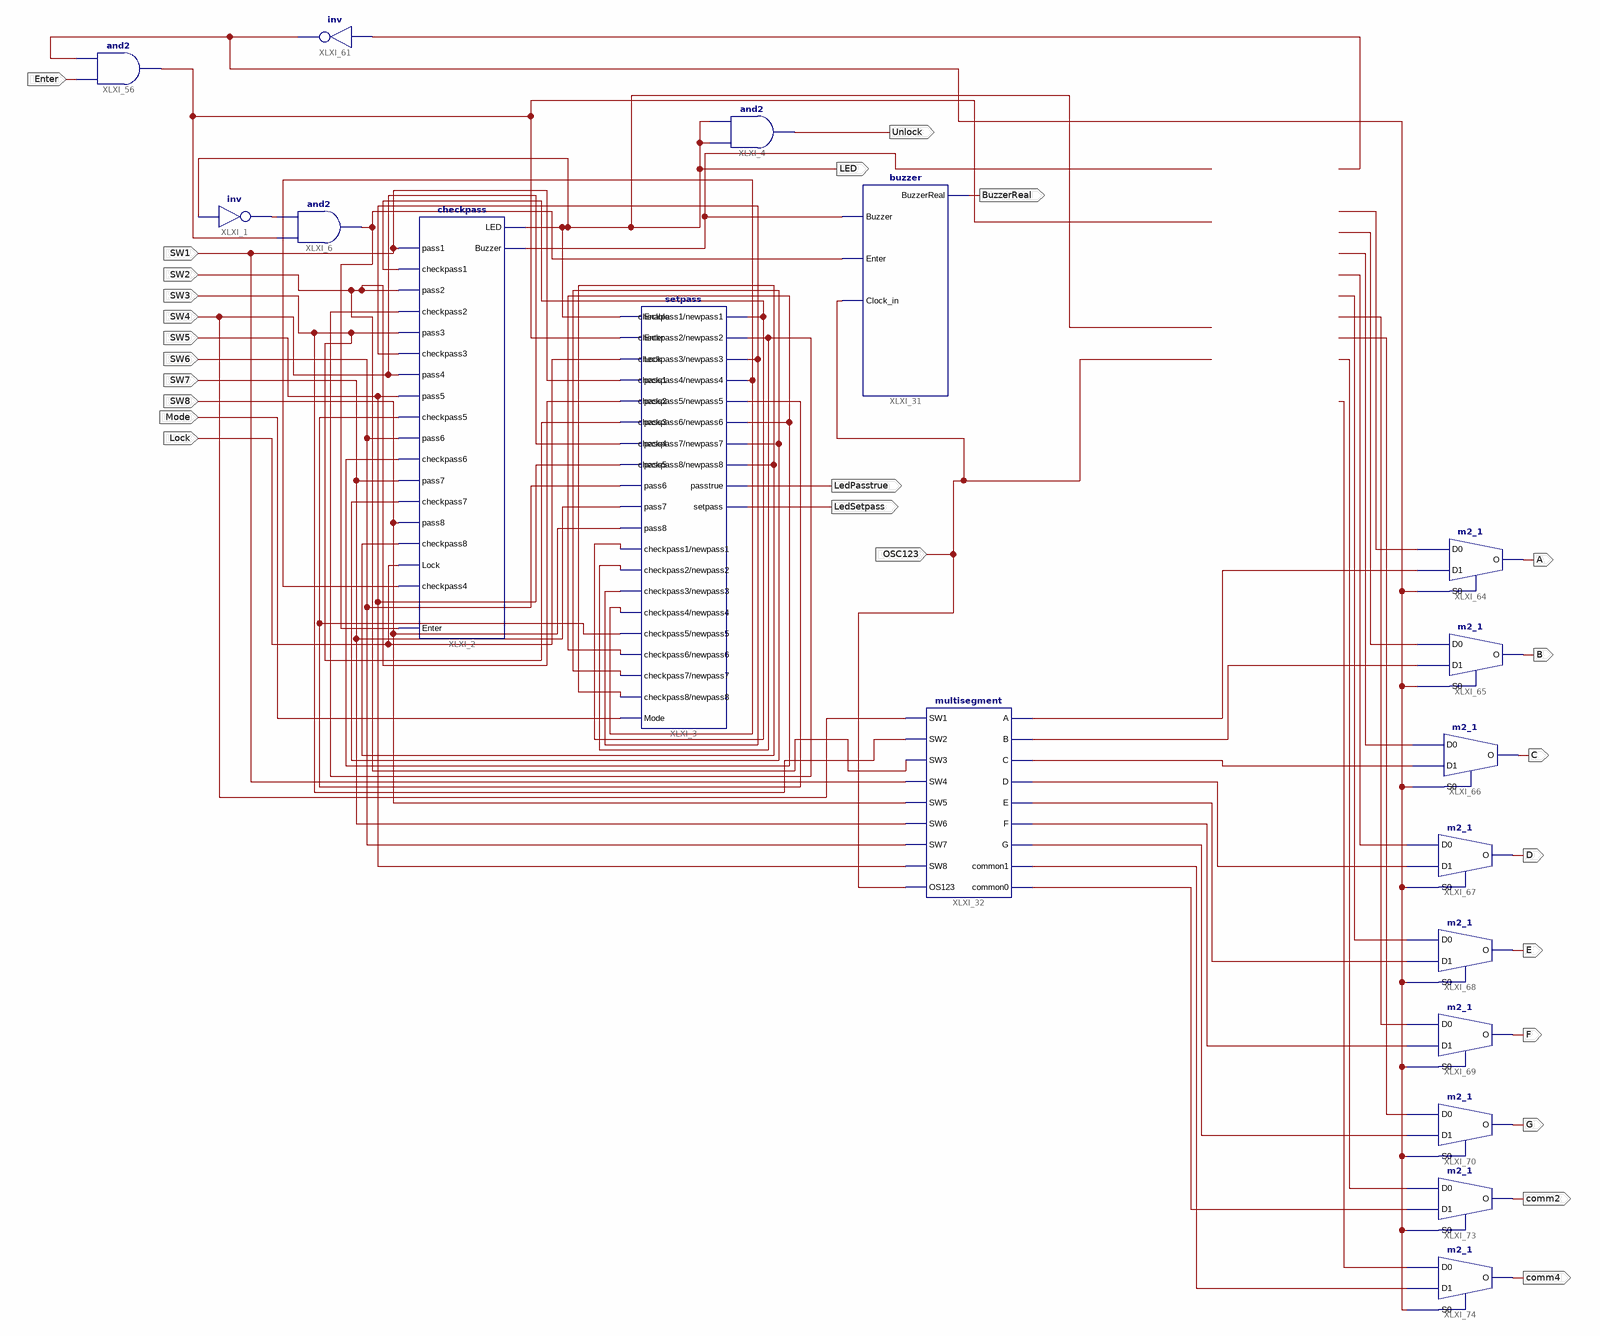
[diagram p0: schematic sheet 1]
// Xilinx ISE schematic test.sch (spartan6) as structural Verilog: 18 symbols, 26 ports
module test (
  input  Lock,
  input  Mode,
  input  SW1,
  input  SW4,
  input  SW5,
  input  SW6,
  input  SW7,
  input  SW8,
  input  SW2,
  input  SW3,
  input  OSC123,
  input  Enter,
  output LedPasstrue,
  output LedSetpass,
  output Unlock,
  output LED,
  output BuzzerReal,
  output comm2,
  output A,
  output B,
  output C,
  output D,
  output E,
  output F,
  output G,
  output comm4
);

  wire XLXN_2, XLXN_3, XLXN_6, XLXN_8, XLXN_10, XLXN_12, XLXN_16, XLXN_18, XLXN_89, XLXN_107, XLXN_109,
       XLXN_359, XLXN_360, XLXN_363, XLXN_364, XLXN_365, XLXN_366, XLXN_367, XLXN_368, XLXN_369, XLXN_371,
       XLXN_372, XLXN_373, XLXN_374, XLXN_375, XLXN_376, XLXN_377, XLXN_379, XLXN_382, XLXN_383, XLXN_403,
       XLXN_404;

  not XLXI_1 (XLXN_3, LED);
  checkpass XLXI_2 (
    .Lock(Lock), .pass1(SW1), .checkpass1(XLXN_16), .pass2(SW2), .checkpass2(XLXN_6), .pass3(SW3),
    .checkpass3(XLXN_107), .pass4(SW4), .checkpass4(XLXN_18), .pass5(SW5), .checkpass5(XLXN_89), .pass6(SW6),
    .checkpass6(XLXN_12), .pass7(SW7), .checkpass7(XLXN_10), .pass8(SW8), .checkpass8(XLXN_8),
    .Enter(XLXN_109), .LED(LED), .Buzzer(XLXN_2));
  setpass XLXI_3 (
    .checkpass1(XLXN_16), .checkpass2(XLXN_6), .checkpass3(XLXN_107), .checkpass4(XLXN_18),
    .checkpass5(XLXN_89), .checkpass6(XLXN_12), .checkpass7(XLXN_10), .checkpass8(XLXN_8), .Enable(LED),
    .Enter(XLXN_359), .Lock(Lock), .Mode(Mode), .newpass1(XLXN_16), .newpass2(XLXN_6), .newpass3(XLXN_107),
    .newpass4(XLXN_18), .newpass5(XLXN_89), .newpass6(XLXN_12), .newpass7(XLXN_10), .newpass8(XLXN_8),
    .pass1(SW1), .pass2(SW2), .pass3(SW3), .pass4(SW4), .pass5(SW5), .pass6(SW6), .pass7(SW7), .pass8(SW8),
    .passtrue(LedPasstrue), .setpass(LedSetpass));
  and XLXI_4 (Unlock, LED, LED);
  buzzer XLXI_31 (.Buzzer(XLXN_2), .Enter(XLXN_109), .Clock_in(OSC123), .BuzzerReal(BuzzerReal));
  and XLXI_6 (XLXN_109, XLXN_359, XLXN_3);
  multisegment XLXI_32 (
    .SW1(SW4), .SW2(SW3), .SW3(SW2), .SW4(SW1), .SW5(SW8), .SW6(SW7), .SW7(SW6), .SW8(SW5), .OS123(OSC123),
    .A(XLXN_364), .B(XLXN_366), .C(XLXN_368), .D(XLXN_371), .E(XLXN_373), .F(XLXN_375), .G(XLXN_376),
    .common1(XLXN_403), .common0(XLXN_404));
  and XLXI_56 (XLXN_359, Enter, XLXN_360);
  not XLXI_61 (XLXN_360, XLXN_383);
  m2_1 XLXI_64 (.D0(XLXN_363), .D1(XLXN_364), .S0(XLXN_360), .O(A));
  m2_1 XLXI_65 (.D0(XLXN_365), .D1(XLXN_366), .S0(XLXN_360), .O(B));
  m2_1 XLXI_66 (.D0(XLXN_367), .D1(XLXN_368), .S0(XLXN_360), .O(C));
  m2_1 XLXI_67 (.D0(XLXN_369), .D1(XLXN_371), .S0(XLXN_360), .O(D));
  m2_1 XLXI_68 (.D0(XLXN_372), .D1(XLXN_373), .S0(XLXN_360), .O(E));
  m2_1 XLXI_69 (.D0(XLXN_374), .D1(XLXN_375), .S0(XLXN_360), .O(F));
  m2_1 XLXI_70 (.D0(XLXN_377), .D1(XLXN_376), .S0(XLXN_360), .O(G));
  m2_1 XLXI_73 (.D0(XLXN_379), .D1(XLXN_404), .S0(XLXN_360), .O(comm2));
  m2_1 XLXI_74 (.D0(XLXN_382), .D1(XLXN_403), .S0(XLXN_360), .O(comm4));

  // Notes on the sheet:
  //   LOC on signal LED = Minor
endmodule
